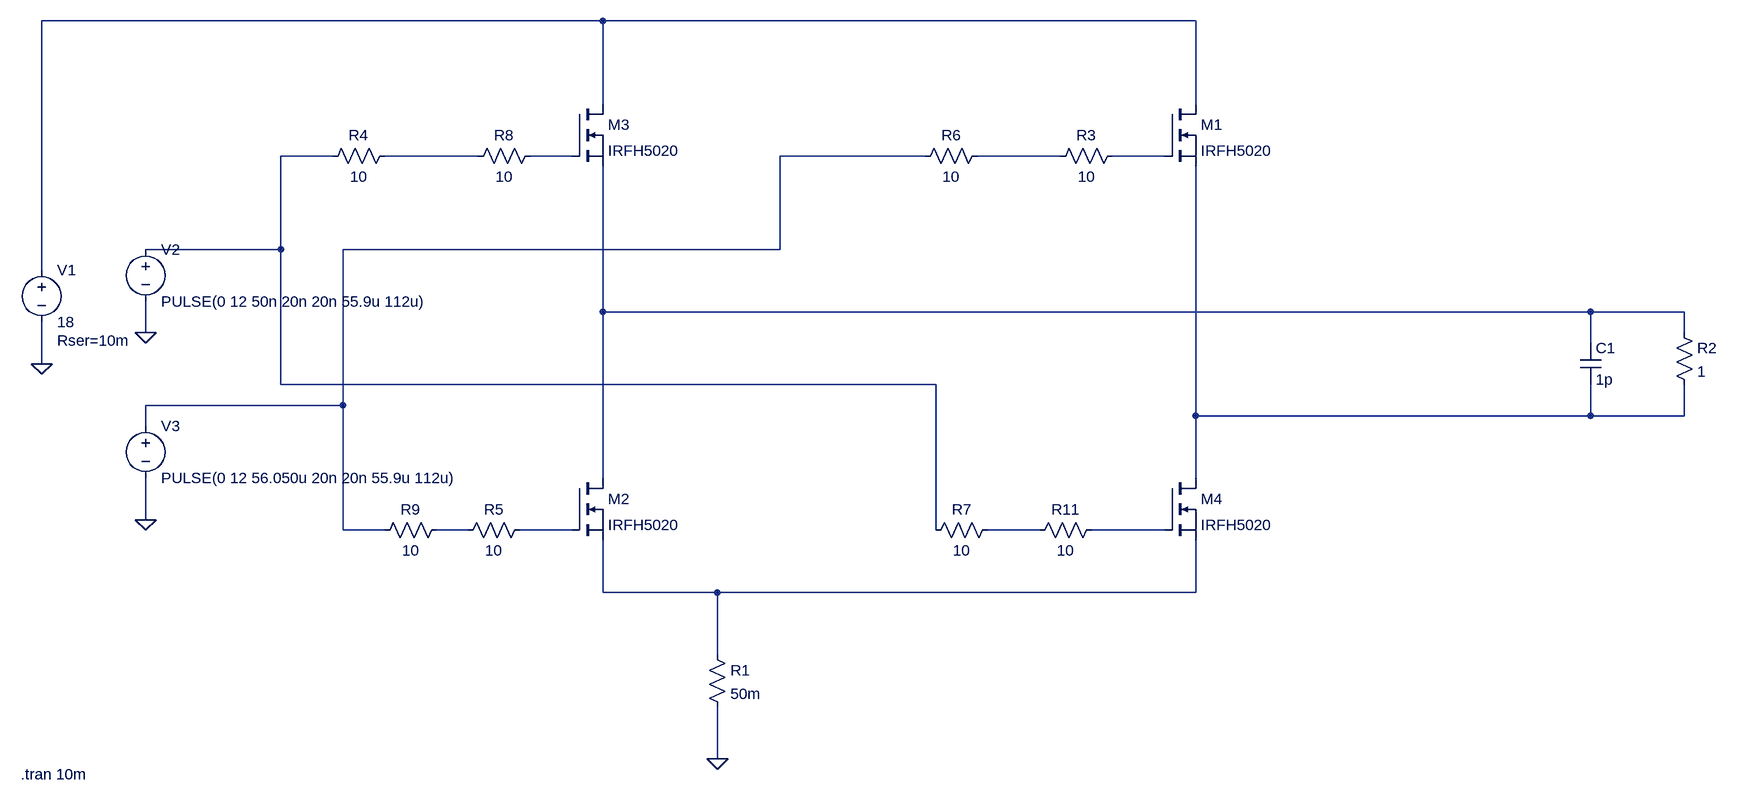
[diagram p0: schematic Booster.asc]
Booster.asc, the LTspice schematic file:
Version 4
SHEET 1 1912 856
WIRE 192 -320 -672 -320
WIRE 1104 -320 192 -320
WIRE 192 -192 192 -320
WIRE 1104 -192 1104 -320
WIRE -224 -112 -304 -112
WIRE 0 -112 -144 -112
WIRE 144 -112 80 -112
WIRE 688 -112 464 -112
WIRE 896 -112 768 -112
WIRE 1056 -112 976 -112
WIRE -304 32 -304 -112
WIRE -304 32 -512 32
WIRE 464 32 464 -112
WIRE 464 32 -208 32
WIRE -672 64 -672 -320
WIRE 192 128 192 -96
WIRE 1712 128 192 128
WIRE 1856 128 1712 128
WIRE -512 160 -512 112
WIRE 1856 160 1856 128
WIRE 1712 176 1712 128
WIRE -672 208 -672 144
WIRE -304 240 -304 32
WIRE 704 240 -304 240
WIRE -208 272 -208 32
WIRE -208 272 -512 272
WIRE 1104 288 1104 -96
WIRE 1712 288 1712 240
WIRE 1712 288 1104 288
WIRE 1856 288 1856 240
WIRE 1856 288 1712 288
WIRE -512 304 -512 272
WIRE 192 384 192 128
WIRE 1104 384 1104 288
WIRE -512 448 -512 384
WIRE -208 464 -208 272
WIRE -144 464 -208 464
WIRE -16 464 -64 464
WIRE 144 464 64 464
WIRE 704 464 704 240
WIRE 864 464 784 464
WIRE 1056 464 944 464
WIRE 192 560 192 480
WIRE 368 560 192 560
WIRE 1104 560 1104 480
WIRE 1104 560 368 560
WIRE 368 656 368 560
WIRE 368 816 368 736
FLAG 368 816 0
FLAG -672 208 0
FLAG -512 160 0
FLAG -512 448 0
SYMBOL nmos 144 384 R0
SYMATTR InstName M2
SYMATTR Value IRFH5020
SYMBOL nmos 1056 384 R0
SYMATTR InstName M4
SYMATTR Value IRFH5020
SYMBOL res 352 640 R0
SYMATTR InstName R1
SYMATTR Value 50m
SYMBOL cap 1696 176 R0
SYMATTR InstName C1
SYMATTR Value 1p
SYMBOL res 1840 144 R0
SYMATTR InstName R2
SYMATTR Value 1
SYMBOL voltage -672 48 R0
WINDOW 123 0 0 Left 2
WINDOW 39 24 124 Left 2
SYMATTR SpiceLine Rser=10m
SYMATTR InstName V1
SYMATTR Value 18
SYMBOL voltage -512 16 R0
WINDOW 123 0 0 Left 2
WINDOW 39 0 0 Left 2
SYMATTR InstName V2
SYMATTR Value PULSE(0 12 50n 20n 20n 55.9u 112u)
SYMBOL voltage -512 288 R0
WINDOW 123 0 0 Left 2
WINDOW 39 0 0 Left 2
SYMATTR InstName V3
SYMATTR Value PULSE(0 12 56.050u 20n 20n 55.9u 112u)
SYMBOL res 992 -128 R90
WINDOW 0 0 56 VBottom 2
WINDOW 3 32 56 VTop 2
SYMATTR InstName R3
SYMATTR Value 10
SYMBOL res 80 448 R90
WINDOW 0 0 56 VBottom 2
WINDOW 3 32 56 VTop 2
SYMATTR InstName R5
SYMATTR Value 10
SYMBOL res 96 -128 R90
WINDOW 0 0 56 VBottom 2
WINDOW 3 32 56 VTop 2
SYMATTR InstName R8
SYMATTR Value 10
SYMBOL res 960 448 R90
WINDOW 0 0 56 VBottom 2
WINDOW 3 32 56 VTop 2
SYMATTR InstName R11
SYMATTR Value 10
SYMBOL nmos 144 -192 R0
SYMATTR InstName M3
SYMATTR Value IRFH5020
SYMBOL nmos 1056 -192 R0
SYMATTR InstName M1
SYMATTR Value IRFH5020
SYMBOL res -128 -128 R90
WINDOW 0 0 56 VBottom 2
WINDOW 3 32 56 VTop 2
SYMATTR InstName R4
SYMATTR Value 10
SYMBOL res 784 -128 R90
WINDOW 0 0 56 VBottom 2
WINDOW 3 32 56 VTop 2
SYMATTR InstName R6
SYMATTR Value 10
SYMBOL res 800 448 R90
WINDOW 0 0 56 VBottom 2
WINDOW 3 32 56 VTop 2
SYMATTR InstName R7
SYMATTR Value 10
SYMBOL res -48 448 R90
WINDOW 0 0 56 VBottom 2
WINDOW 3 32 56 VTop 2
SYMATTR InstName R9
SYMATTR Value 10
TEXT -704 840 Left 2 !.tran 10m

The netlist it stands for:
* Booster.asc
M2 N008 N011 N014 N014 IRFH5020
M4 N009 N013 N014 N014 IRFH5020
R1 N014 0 50m
C1 N008 N009 1p
R2 N008 N009 1
V1 N001 0 18 Rser=10m
V2 N002 0 PULSE(0 12 50n 20n 20n 55.9u 112u)
V3 N005 0 PULSE(0 12 56.050u 20n 20n 55.9u 112u)
R3 N007 N006 10
R5 N011 N010 10
R8 N004 N003 10
R11 N013 N012 10
M3 N001 N004 N008 N008 IRFH5020
M1 N001 N007 N009 N009 IRFH5020
R4 N003 N002 10
R6 N006 N005 10
R7 N012 N002 10
R9 N010 N005 10
.model NMOS NMOS
.model PMOS PMOS
.lib standard.mos
.tran 10m
.backanno
.end